# Altium project RLCD_SCH_28LED_v1p13p2.PrjPcb
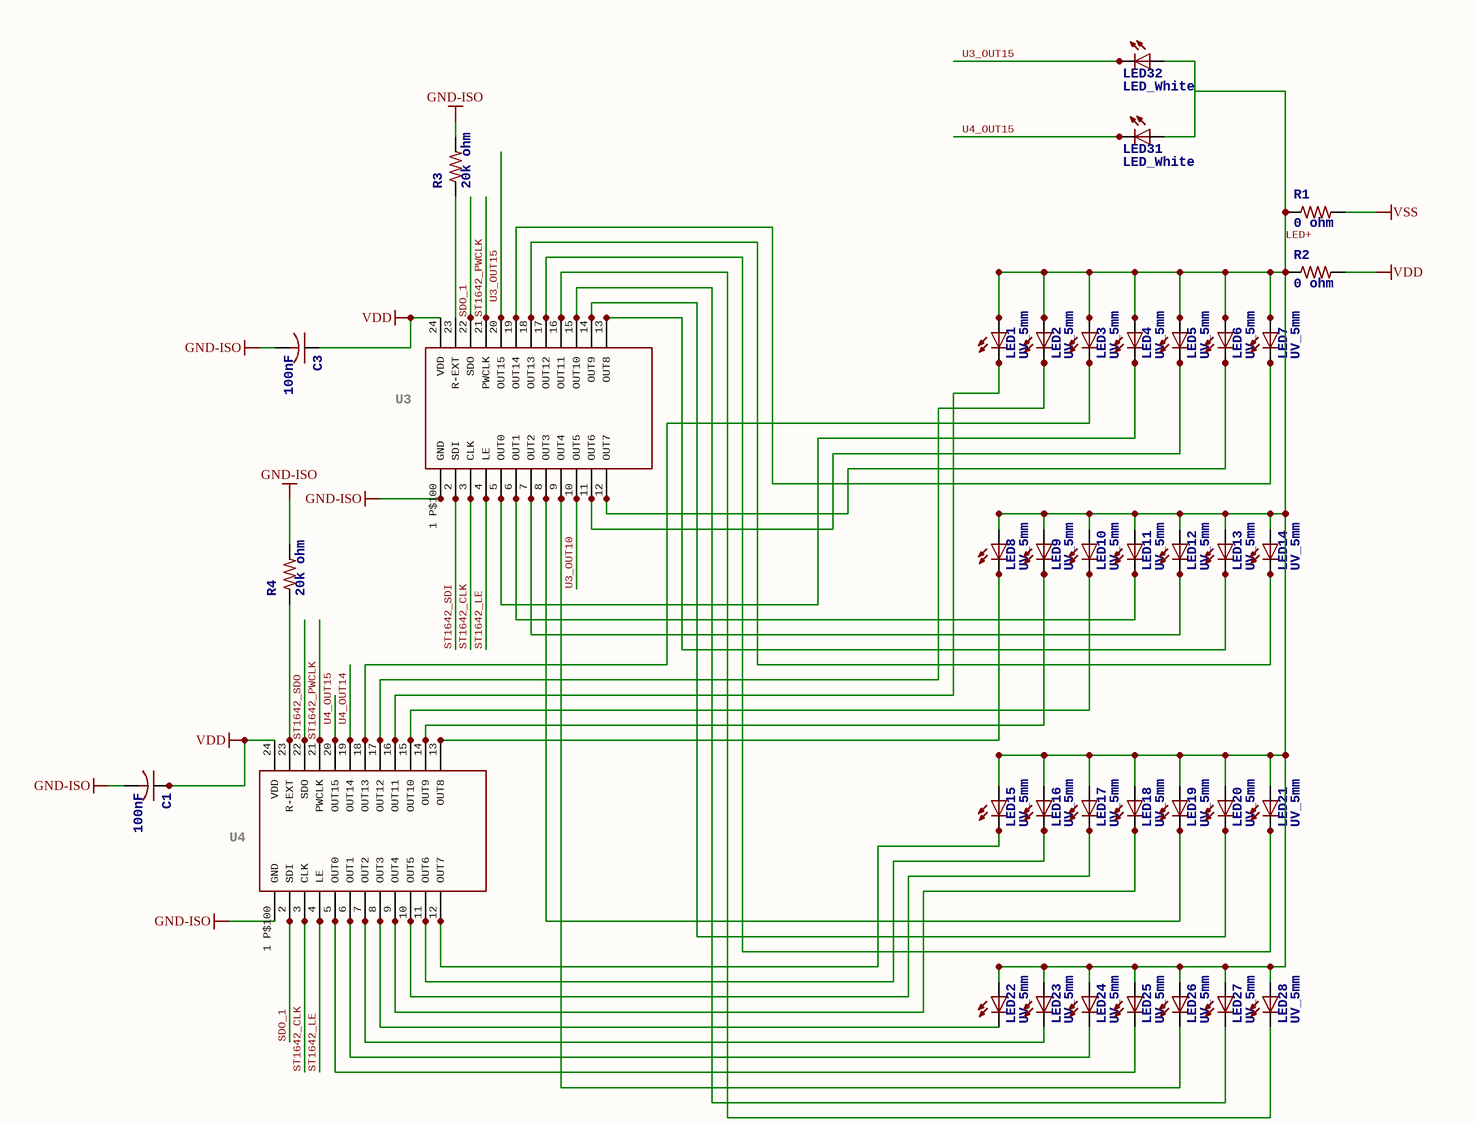
[diagram p0: RLCD_SCH_28LED_v1p13p2.SchDoc, top left]
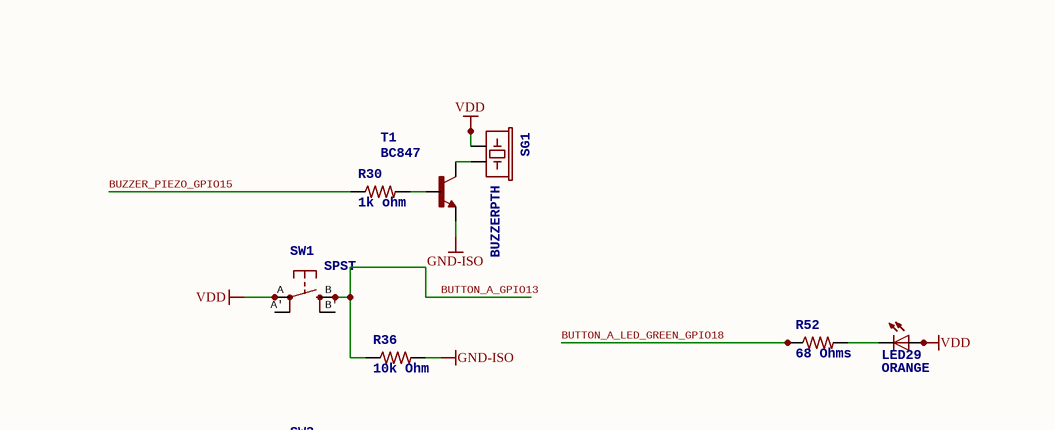
[diagram p1: RLCD_SCH_28LED_v1p13p2.SchDoc, top right]
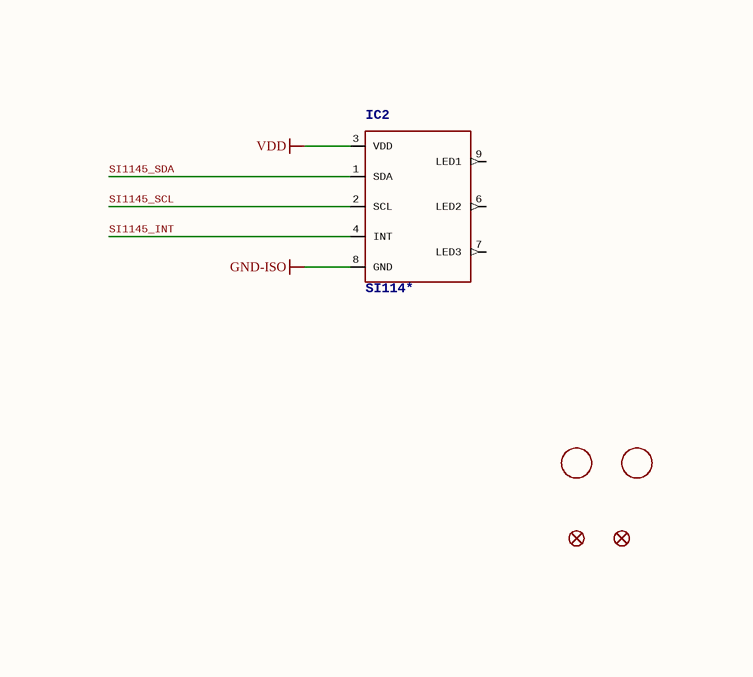
[diagram p2: RLCD_SCH_28LED_v1p13p2.SchDoc, bottom left]
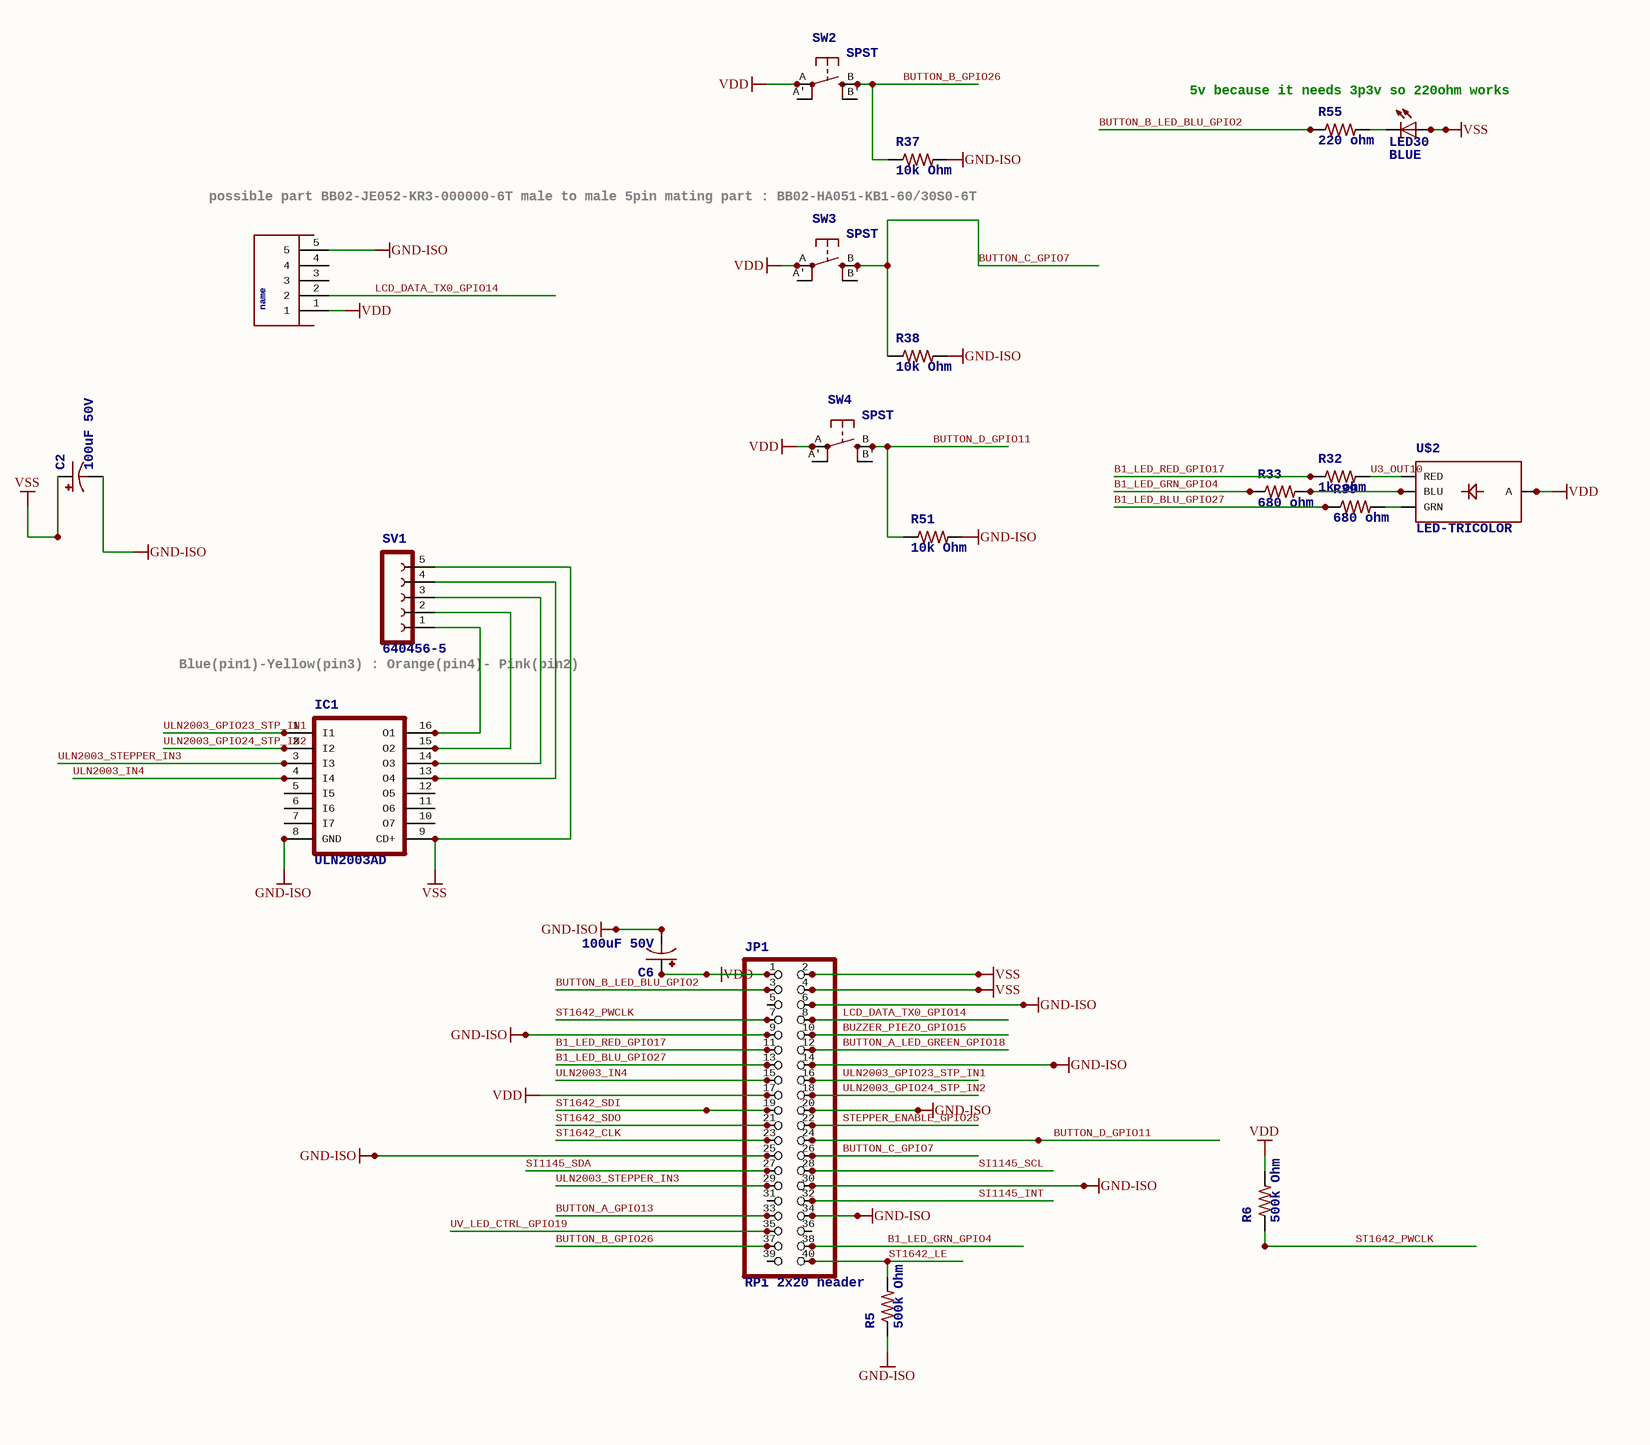
[diagram p3: RLCD_SCH_28LED_v1p13p2.SchDoc, bottom right]
1 sheet, 70 parts. Net scope: global (net labels, ports and power ports of the same name join across sheets).
Board file: RLCD_SCH_28LED_v1p13p2.PcbDoc

## Sheet RLCD_SCH_28LED_v1p13p2.SchDoc
size 514 x 371 mm; DATABASE: ../../../../../Documents/eagle/mouserdb.txt

### Parts
C1  >NAME: C1  [C0805]  (hidden comment: 100nF)
C2  >NAME: C2  [E3,5-8]  (hidden comment: 100uF 50V)
C3  >NAME: C3  [C0805]  (hidden comment: 100nF)
C6  >NAME: C6  [E3,5-8]  (hidden comment: 100uF 50V)
FID1  FIDUCIAL1X2  [FIDUCIAL-1X2]  (value not drawn)
FID2  FIDUCIAL1X2  [FIDUCIAL-1X2]  (value not drawn)
IC1  >NAME: IC1  [SO16]  (hidden comment: ULN2003AD)
IC2  >NAME: IC2  [QFN-10]  (hidden comment: SI114*)
JP1  >NAME: JP1  [2X20]  (hidden comment: RPi 2x20 header)
LED1  >NAME: LED1  [LED5MM]  (hidden comment: UV_5mm)
LED2  >NAME: LED2  [LED5MM]  (hidden comment: UV_5mm)
LED3  >NAME: LED3  [LED5MM]  (hidden comment: UV_5mm)
LED4  >NAME: LED4  [LED5MM]  (hidden comment: UV_5mm)
LED5  >NAME: LED5  [LED5MM]  (hidden comment: UV_5mm)
LED6  >NAME: LED6  [LED5MM]  (hidden comment: UV_5mm)
LED7  >NAME: LED7  [LED5MM]  (hidden comment: UV_5mm)
LED8  >NAME: LED8  [LED5MM]  (hidden comment: UV_5mm)
LED9  >NAME: LED9  [LED5MM]  (hidden comment: UV_5mm)
LED10  >NAME: LED10  [LED5MM]  (hidden comment: UV_5mm)
LED11  >NAME: LED11  [LED5MM]  (hidden comment: UV_5mm)
LED12  >NAME: LED12  [LED5MM]  (hidden comment: UV_5mm)
LED13  >NAME: LED13  [LED5MM]  (hidden comment: UV_5mm)
LED14  >NAME: LED14  [LED5MM]  (hidden comment: UV_5mm)
LED15  >NAME: LED15  [LED5MM]  (hidden comment: UV_5mm)
LED16  >NAME: LED16  [LED5MM]  (hidden comment: UV_5mm)
LED17  >NAME: LED17  [LED5MM]  (hidden comment: UV_5mm)
LED18  >NAME: LED18  [LED5MM]  (hidden comment: UV_5mm)
LED19  >NAME: LED19  [LED5MM]  (hidden comment: UV_5mm)
LED20  >NAME: LED20  [LED5MM]  (hidden comment: UV_5mm)
LED21  >NAME: LED21  [LED5MM]  (hidden comment: UV_5mm)
LED22  >NAME: LED22  [LED5MM]  (hidden comment: UV_5mm)
LED23  >NAME: LED23  [LED5MM]  (hidden comment: UV_5mm)
LED24  >NAME: LED24  [LED5MM]  (hidden comment: UV_5mm)
LED25  >NAME: LED25  [LED5MM]  (hidden comment: UV_5mm)
LED26  >NAME: LED26  [LED5MM]  (hidden comment: UV_5mm)
LED27  >NAME: LED27  [LED5MM]  (hidden comment: UV_5mm)
LED28  >NAME: LED28  [LED5MM]  (hidden comment: UV_5mm)
LED29  >NAME: LED29  [CHIPLED_1206]  (hidden comment: ORANGE)
LED30  >NAME: LED30  [CHIPLED_1206]  (hidden comment: BLUE)
LED31  >NAME: LED31  [CHIPLED_1206]  (hidden comment: LED_White)
LED32  >NAME: LED32  [CHIPLED_1206]  (hidden comment: LED_White)
R1  >NAME: R1  [0805]  (hidden comment: 0 ohm)
R2  >NAME: R2  [0805]  (hidden comment: 0 ohm)
R3  >NAME: R3  [0805]  (hidden comment: 20k ohm)
R4  >NAME: R4  [0805]  (hidden comment: 20k ohm)
R5  >NAME: R5  [0805]  (hidden comment: 500k Ohm)
R6  >NAME: R6  [0805]  (hidden comment: 500k Ohm)
R30  >NAME: R30  [0805]  (hidden comment: 1k ohm)
R32  >NAME: R32  [0805]  (hidden comment: 1k ohm)
R33  >NAME: R33  [0805]  (hidden comment: 680 ohm)
R36  >NAME: R36  [0805]  (hidden comment: 10k Ohm)
R37  >NAME: R37  [0805]  (hidden comment: 10k Ohm)
R38  >NAME: R38  [0805]  (hidden comment: 10k Ohm)
R39  >NAME: R39  [0805]  (hidden comment: 680 ohm)
R51  >NAME: R51  [0805]  (hidden comment: 10k Ohm)
R52  >NAME: R52  [0805]  (hidden comment: 68 Ohms)
R55  >NAME: R55  [0805]  (hidden comment: 220 ohm)
SG1  >NAME: SG1  [BUZZER-12MM]  (hidden comment: BUZZERPTH)
SV1  >NAME: SV1  [FE05-1]  (hidden comment: 640456-5)
SV3_LCD_HEADER  22-05-2051  [MDF7-5S-2.54DSA]  (value not drawn)
SW1  >NAME: SW1  [EVQ-Q2]  (hidden comment: SPST)
SW2  >NAME: SW2  [EVQ-Q2]  (hidden comment: SPST)
SW3  >NAME: SW3  [EVQ-Q2]  (hidden comment: SPST)
SW4  >NAME: SW4  [EVQ-Q2]  (hidden comment: SPST)
T1  >NAME: T1  [SOT23]  (hidden comment: BC847)
U$1  FIDUCIAL  [FIDUCIAL_1MM]  (value not drawn)
U$2  >NAME: U$2  [LED-TRICOLOR-SMD]  (hidden comment: LED-TRICOLOR)
U$3  LED1642GWTTR  [TSSOP24]  (value not drawn)
U$4  LED1642GWTTR  [TSSOP24]  (value not drawn)
U$5  FIDUCIAL  [FIDUCIAL_1MM]  (value not drawn)

### Nets
GND-ISO: C1.2 C2.- C3.2 C6.- IC1.8(GND) IC2.8(GND) JP1.6 JP1.9 JP1.14 JP1.20 JP1.25 JP1.30 JP1.34 R3.2 R4.2 R5.1 R36.2 R37.2 R38.2 R51.2 SV3_LCD_HEADER.5 T1.2(E) U$3.1_P$100(GND) U$4.1_P$100(GND)
VDD: C1.1 C3.1 C6.+ IC2.3(VDD) JP1.1 JP1.17 LED29.A R2.2 R6.2 SG1.+ SV3_LCD_HEADER.1 SW1.A(P) SW2.A(P) SW3.A(P) SW4.A(P) U$2.A U$3.24(VDD) U$4.24(VDD)
VSS: C2.+ IC1.9(CD+) JP1.2 JP1.4 LED30.A R1.2 SV1.5
B1_LED_BLU_GPIO27: JP1.13 R39.1
B1_LED_GRN_GPIO4: JP1.38 R33.1
B1_LED_RED_GPIO17: JP1.11 R32.1
BUTTON_A_GPIO13: JP1.33 R36.1 SW1.B(S)
BUTTON_A_LED_GREEN_GPIO18: JP1.12 R52.1
BUTTON_B_GPIO26: JP1.37 R37.1 SW2.B(S)
BUTTON_B_LED_BLU_GPIO2: JP1.3 R55.1
BUTTON_C_GPIO7: JP1.26 R38.1 SW3.B(S)
BUTTON_D_GPIO11: JP1.24 R51.1 SW4.B(S)
BUZZER_PIEZO_GPIO15: JP1.10 R30.1
LCD_DATA_TX0_GPIO14: JP1.8 SV3_LCD_HEADER.2
LED+: LED1.A LED2.A LED3.A LED4.A LED5.A LED6.A LED7.A LED8.A LED9.A LED10.A LED11.A LED12.A LED13.A LED14.A LED15.A LED16.A LED17.A LED18.A LED19.A LED20.A LED21.A LED22.A LED23.A LED24.A LED25.A LED26.A LED27.A LED28.A LED31.A LED32.A R1.1 R2.1
SDO_1: U$3.22(SDO) U$4.2(SDI)
SI1145_INT: IC2.4(INT) JP1.32
SI1145_SCL: IC2.2(SCL) JP1.28
SI1145_SDA: IC2.1(SDA) JP1.27
ST1642_CLK: JP1.23 U$3.3(CLK) U$4.3(CLK)
ST1642_LE: JP1.40 R5.2 U$3.4(LE) U$4.4(LE)
ST1642_PWCLK: JP1.7 R6.1 U$3.21(PWCLK) U$4.21(PWCLK)
ST1642_SDI: JP1.19 U$3.2(SDI)
ST1642_SDO: JP1.21 U$4.22(SDO)
STEPPER_ENABLE_GPIO25: JP1.22
U3_OUT10: R32.2 U$2.R(RED) U$3.10(OUT5)
U3_OUT15: LED32.C U$3.20(OUT15)
U4_OUT14: U$4.19(OUT14)
U4_OUT15: LED31.C U$4.20(OUT15)
ULN2003_GPIO23_STP_IN1: IC1.1(I1) JP1.16
ULN2003_GPIO24_STP_IN2: IC1.2(I2) JP1.18
ULN2003_IN4: IC1.4(I4) JP1.15
ULN2003_STEPPER_IN3: IC1.3(I3) JP1.29
UV_LED_CTRL_GPIO19: JP1.35
NetIC1_13: IC1.13(O4) SV1.4
NetIC1_14: IC1.14(O3) SV1.3
NetIC1_15: IC1.15(O2) SV1.2
NetIC1_16: IC1.16(O1) SV1.1
NetLED1_K: LED1.K(C) U$4.16(OUT11)
NetLED2_K: LED2.K(C) U$4.17(OUT12)
NetLED3_K: LED3.K(C) U$4.18(OUT13)
NetLED4_K: LED4.K(C) U$3.5(OUT0)
NetLED5_K: LED5.K(C) U$3.11(OUT6)
NetLED6_K: LED6.K(C) U$3.12(OUT7)
NetLED7_K: LED7.K(C) U$3.19(OUT14)
NetLED8_K: LED8.K(C) U$4.13(OUT8)
NetLED9_K: LED9.K(C) U$4.14(OUT9)
NetLED10_K: LED10.K(C) U$4.15(OUT10)
NetLED11_K: LED11.K(C) U$3.6(OUT1)
NetLED12_K: LED12.K(C) U$3.7(OUT2)
NetLED13_K: LED13.K(C) U$3.13(OUT8)
NetLED14_K: LED14.K(C) U$3.18(OUT13)
NetLED15_K: LED15.K(C) U$4.12(OUT7)
NetLED16_K: LED16.K(C) U$4.11(OUT6)
NetLED17_K: LED17.K(C) U$4.10(OUT5)
NetLED18_K: LED18.K(C) U$4.9(OUT4)
NetLED19_K: LED19.K(C) U$3.8(OUT3)
NetLED20_K: LED20.K(C) U$3.14(OUT9)
NetLED21_K: LED21.K(C) U$3.17(OUT12)
NetLED22_K: LED22.K(C) U$4.8(OUT3)
NetLED23_K: LED23.K(C) U$4.7(OUT2)
NetLED24_K: LED24.K(C) U$4.6(OUT1)
NetLED25_K: LED25.K(C) U$4.5(OUT0)
NetLED26_K: LED26.K(C) U$3.9(OUT4)
NetLED27_K: LED27.K(C) U$3.15(OUT10)
NetLED28_K: LED28.K(C) U$3.16(OUT11)
NetLED29_C: LED29.C R52.2
NetLED30_C: LED30.C R55.2
NetR3_1: R3.1 U$3.23(R-EXT)
NetR4_1: R4.1 U$4.23(R-EXT)
NetR30_2: R30.2 T1.1(B)
NetR33_2: R33.2 U$2.B(BLU)
NetR39_2: R39.2 U$2.G(GRN)
NetSG1_-: SG1.- T1.3(C)

Not connected (* = marked no-connect by the designer): IC1 5(I5) 6(I6) 7(I7) 10(O7) 11(O6) 12(O5); IC2 6(LED2) 7(LED3) 9(LED1); JP1 5 31 36 39; SV3_LCD_HEADER 3 4; SW1 A'(P1) B'(S1); SW2 A'(P1) B'(S1); SW3 A'(P1) B'(S1); SW4 A'(P1) B'(S1)

### Notes on the sheet
- (near U$3) U3
- (near U$4) U4
- 5v because it needs 3p3v so 220ohm works
- possible part BB02-JE052-KR3-000000-6T
  male to male 5pin mating part : BB02-HA051-KB1-60/30S0-6T
- (near SV1) Blue(pin1)-Yellow(pin3) : Orange(pin4)- Pink(pin2)

### Library data of the parts
C1 C3 = C-USC0805: <B>CAPACITOR</B>, American symbol; >VALUE: 100nF
C2 C6 = CPOL-USE3.5-8: <B>POLARIZED CAPACITOR</B>, American symbol; PARTNO: REA101M1HBK-0811P; >VALUE: 100uF 50V
FID1 FID2 = FIDUCIAL1X2: <b>Fiducial Alignment Points</b> / Various fiducial points for machine vision alignment.
IC1 = ULN2003AD: <b>DRIVER ARRAY</b>; >VALUE: ULN2003AD
IC2 = SI114*: <b>PROXIMITY/UV/AMBIENT LIGHT SENSOR IC WITH I2C INTERFACE</b><p> / Source: http://www.silabs.com/Support%20Documents/TechnicalDocs/Si1145-46-47.pdf; >VALUE: SI114*
JP1 = PINHD-2X20: <b>PIN HEADER</b>; PARTNO: 929975-01-13-RK; >VALUE: RPi 2x20 header
LED1-LED28 = LED5MM: <b>LED</b><p> / <u>OSRAM</u>:<br> / - <u>CHIPLED</u><br> / LG R971, LG N971, LY N971, LG Q971, LY Q971, LO R971, LY R971 / LH N974, LH R974<br> / LS Q976, LO Q976, LY Q976<br> / LO Q996<br> / - <u>Hyper CHIPLED</u><br> / LW Q18S<br> / LB Q993, LB Q99A, LB R99A<br> / - <u>SideLED</u><br> / LS A670, LO A670, LY A670, LG A670, LP A670<br> / LB A673, LV A673, LT A673, LW A673<br> / LH A674<br> / LY A675<br> / LS A676, LA A676, LO A676, LY A676, LW A676<br> / LS A679, LY A679, LG A679<br> / -  <u>Hyper Micro SIDELED®</u><br> / LS Y876, LA Y876, LO Y876, LY Y876<br> / LT Y87S<br> / - <u>SmartLED</u><br> / LW L88C, LW L88S<br> / LB L89C, LB L89S, LG L890<br> / LS L89K, LO L89K, LY L89K<br> / LS L896, LA L896, LO L896, LY L896<br> / - <u>TOPLED</u><br> / LS T670, LO T670, LY T670, LG T670, LP T670<br> / LSG T670, LSP T670, LSY T670, LOP T670, LYG T670<br> / LG T671, LOG T671, LSG T671<br> / LB T673, LV T673, LT T673, LW T673<br> / LH T674<br> / LS T676, LA T676, LO T676, LY T676, LB T676, LH T676, LSB T676, LW T676<br> / LB T67C, LV T67C, LT T67C, LS T67K, LO T67K, LY T67K, LW E67C<br> / LS E67B, LA E67B, LO E67B, LY E67B, LB E67C, LV E67C, LT E67C<br> / LW T67C<br> / LS T679, LY T679, LG T679<br> / LS T770, LO T770, LY T770, LG T770, LP T770<br> / LB T773, LV T773, LT T773, LW T773<br> / LH T774<br> / LS E675, LA E675, LY E675, LS T675<br> / LS T776, LA T776, LO T776, LY T776, LB T776<br> / LHGB T686<br> / LT T68C, LB T68C<br> / - <u>Hyper Mini TOPLED®</u><br> / LB M676<br> / - <u>Mini TOPLED Santana®</u><br> / LG M470<br> / LS M47K, LO M47K, LY M47K / <p> / Source: http://www.osram.convergy.de<p> / <u>LUXEON:</u><br> / - <u>LUMILED®</u><br> / LXK2-PW12-R00, LXK2-PW12-S00, LXK2-PW14-U00, LXK2-PW14-V00<br> / LXK2-PM12-R00, LXK2-PM12-S00, LXK2-PM14-U00<br> / LXK2-PE12-Q00, LXK2-PE12-R00, LXK2-PE12-S00, LXK2-PE14-T00, LXK2-PE14-U00<br> / LXK2-PB12-K00, LXK2-PB12-L00, LXK2-PB12-M00, LXK2-PB14-N00, LXK2-PB14-P00, LXK2-PB14-Q00<br> / LXK2-PR12-L00, LXK2-PR12-M00, LXK2-PR14-Q00, LXK2-PR14-R00<br> / LXK2-PD12-Q00, LXK2-PD12-R00, LXK2-PD12-S00<br> / LXK2-PH12-R00, LXK2-PH12-S00<br> / LXK2-PL12-P00, LXK2-PL12-Q00, LXK2-PL12-R00 / <p> / Source: www.luxeon.com<p> / <u>KINGBRIGHT:</U><p> / KA-3528ASYC<br> / Source: www.kingbright.com; PARTNO: *; >VALUE: UV_5mm
LED29 LED31 LED32 = LEDCHIPLED_1206: <b>LED</b><p> / <u>OSRAM</u>:<br> / - <u>CHIPLED</u><br> / LG R971, LG N971, LY N971, LG Q971, LY Q971, LO R971, LY R971 / LH N974, LH R974<br> / LS Q976, LO Q976, LY Q976<br> / LO Q996<br> / - <u>Hyper CHIPLED</u><br> / LW Q18S<br> / LB Q993, LB Q99A, LB R99A<br> / - <u>SideLED</u><br> / LS A670, LO A670, LY A670, LG A670, LP A670<br> / LB A673, LV A673, LT A673, LW A673<br> / LH A674<br> / LY A675<br> / LS A676, LA A676, LO A676, LY A676, LW A676<br> / LS A679, LY A679, LG A679<br> / -  <u>Hyper Micro SIDELED®</u><br> / LS Y876, LA Y876, LO Y876, LY Y876<br> / LT Y87S<br> / - <u>SmartLED</u><br> / LW L88C, LW L88S<br> / LB L89C, LB L89S, LG L890<br> / LS L89K, LO L89K, LY L89K<br> / LS L896, LA L896, LO L896, LY L896<br> / - <u>TOPLED</u><br> / LS T670, LO T670, LY T670, LG T670, LP T670<br> / LSG T670, LSP T670, LSY T670, LOP T670, LYG T670<br> / LG T671, LOG T671, LSG T671<br> / LB T673, LV T673, LT T673, LW T673<br> / LH T674<br> / LS T676, LA T676, LO T676, LY T676, LB T676, LH T676, LSB T676, LW T676<br> / LB T67C, LV T67C, LT T67C, LS T67K, LO T67K, LY T67K, LW E67C<br> / LS E67B, LA E67B, LO E67B, LY E67B, LB E67C, LV E67C, LT E67C<br> / LW T67C<br> / LS T679, LY T679, LG T679<br> / LS T770, LO T770, LY T770, LG T770, LP T770<br> / LB T773, LV T773, LT T773, LW T773<br> / LH T774<br> / LS E675, LA E675, LY E675, LS T675<br> / LS T776, LA T776, LO T776, LY T776, LB T776<br> / LHGB T686<br> / LT T68C, LB T68C<br> / - <u>Hyper Mini TOPLED®</u><br> / LB M676<br> / - <u>Mini TOPLED Santana®</u><br> / LG M470<br> / LS M47K, LO M47K, LY M47K<br> / <p> / Source: http://www.osram.convergy.de/; PARTNO: LG N971-KN-1
  LED29: >VALUE: ORANGE
  LED31 LED32: >VALUE: LED_White
LED30 = LEDCHIPLED_1206: <b>LED</b><p> / <u>OSRAM</u>:<br> / - <u>CHIPLED</u><br> / LG R971, LG N971, LY N971, LG Q971, LY Q971, LO R971, LY R971 / LH N974, LH R974<br> / LS Q976, LO Q976, LY Q976<br> / LO Q996<br> / - <u>Hyper CHIPLED</u><br> / LW Q18S<br> / LB Q993, LB Q99A, LB R99A<br> / - <u>SideLED</u><br> / LS A670, LO A670, LY A670, LG A670, LP A670<br> / LB A673, LV A673, LT A673, LW A673<br> / LH A674<br> / LY A675<br> / LS A676, LA A676, LO A676, LY A676, LW A676<br> / LS A679, LY A679, LG A679<br> / -  <u>Hyper Micro SIDELED®</u><br> / LS Y876, LA Y876, LO Y876, LY Y876<br> / LT Y87S<br> / - <u>SmartLED</u><br> / LW L88C, LW L88S<br> / LB L89C, LB L89S, LG L890<br> / LS L89K, LO L89K, LY L89K<br> / LS L896, LA L896, LO L896, LY L896<br> / - <u>TOPLED</u><br> / LS T670, LO T670, LY T670, LG T670, LP T670<br> / LSG T670, LSP T670, LSY T670, LOP T670, LYG T670<br> / LG T671, LOG T671, LSG T671<br> / LB T673, LV T673, LT T673, LW T673<br> / LH T674<br> / LS T676, LA T676, LO T676, LY T676, LB T676, LH T676, LSB T676, LW T676<br> / LB T67C, LV T67C, LT T67C, LS T67K, LO T67K, LY T67K, LW E67C<br> / LS E67B, LA E67B, LO E67B, LY E67B, LB E67C, LV E67C, LT E67C<br> / LW T67C<br> / LS T679, LY T679, LG T679<br> / LS T770, LO T770, LY T770, LG T770, LP T770<br> / LB T773, LV T773, LT T773, LW T773<br> / LH T774<br> / LS E675, LA E675, LY E675, LS T675<br> / LS T776, LA T776, LO T776, LY T776, LB T776<br> / LHGB T686<br> / LT T68C, LB T68C<br> / - <u>Hyper Mini TOPLED®</u><br> / LB M676<br> / - <u>Mini TOPLED Santana®</u><br> / LG M470<br> / LS M47K, LO M47K, LY M47K<br> / <p> / Source: http://www.osram.convergy.de/; PARTNO: LTST-C21TBKT; >VALUE: BLUE
R1-R4 = RESISTOR0805-RES: <b>Resistor</b> / Basic schematic elements and footprints for 0603, 1206, and PTH resistors.; PARTNO: DNP
  R1 R2: >VALUE: 0 ohm
  R3 R4: >VALUE: 20k ohm
R5 R6 R36-R38 R51 = RESISTOR0805-RES: <b>Resistor</b> / Basic schematic elements and footprints for 0603, 1206, and PTH resistors.; PARTNO: RK73B2ATTD103J
  R5 R6: >VALUE: 500k Ohm
  R36-R38 R51: >VALUE: 10k Ohm
R30 R32 = RESISTOR0805-RES: <b>Resistor</b> / Basic schematic elements and footprints for 0603, 1206, and PTH resistors.; PARTNO: RK73H2ATTD1001F; >VALUE: 1k ohm
R33 R39 = RESISTOR0805-RES: <b>Resistor</b> / Basic schematic elements and footprints for 0603, 1206, and PTH resistors.; PARTNO: RK73B2ATTD681J; >VALUE: 680 ohm
R52 = RESISTOR0805-RES: <b>Resistor</b> / Basic schematic elements and footprints for 0603, 1206, and PTH resistors.; PARTNO: RK73B2ATTDD121J; >VALUE: 68 Ohms
R55 = RESISTOR0805-RES: <b>Resistor</b> / Basic schematic elements and footprints for 0603, 1206, and PTH resistors.; PARTNO: RK73B2ATTD221J; >VALUE: 220 ohm
SG1 = BUZZERPTH: <b>Buzzer 12mm</b> / Spark Fun Electronics SKU : Comp-Buzzer; PARTNO: AT-1220-TT-R; >VALUE: BUZZERPTH
SV1 = FE05-1: <b>FEMALE HEADER</b>; OC_FARNELL: unknown; OC_NEWARK: unknown; PARTNO: 640456-5; >VALUE: 640456-5
SV3_LCD_HEADER = MDF7-5S-2.54DSA: PARTNO: MDF7-5S-2.54DSA(55); name: name
SW1-SW4 = SPST_TACT-EVQQ2: SMT 6mm switch, EVQQ2 series / <p>http://www.ladyada.net/library/eagle</p>; >VALUE: SPST
T1 = BC847: <b>NPN TRANSISTOR</b>; PARTNO: MMUN2214LT1G; >VALUE: BC847
U$1 U$5 = FIDUCIAL: For use by pick and place machines to calibrate the vision/machine, 1mm / <p>By microbuilder.eu</p>
U$2 = LED-TRICOLOR: <b>Tri-Color LED SMD</b> / Proven layout and schematic for triple color LED in SMD package - common anode. Spark Fun Electronics SKU : COM-07844; PARTNO: CLV1A-FKB-CHMKPEHBB7A363; >VALUE: LED-TRICOLOR